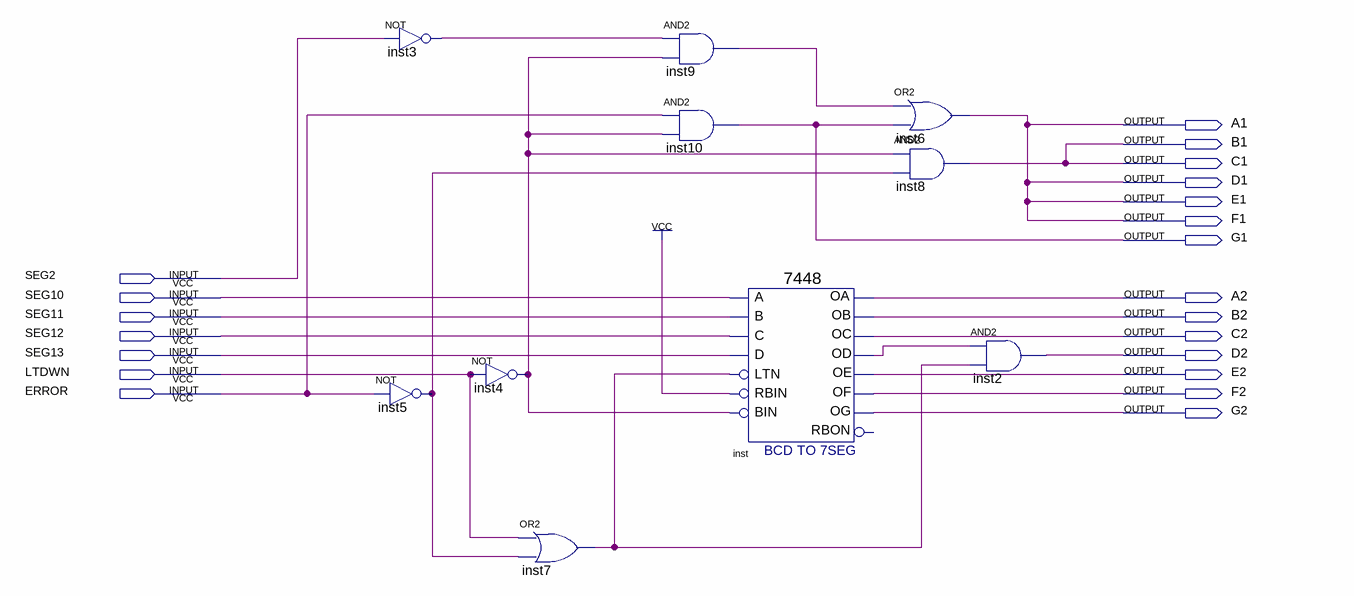
[diagram p0: schematic sheet]
// Quartus schematic display.bdf as structural Verilog: 10 symbols, 21 pins
module display (
  input  SEG2,
  input  SEG10,
  input  SEG11,
  input  SEG12,
  input  SEG13,
  input  LTDWN,
  input  ERROR,
  output A1,
  output B1,
  output C1,
  output D1,
  output E1,
  output F1,
  output G1,
  output A2,
  output B2,
  output C2,
  output D2,
  output E2,
  output F2,
  output G2
);

  wire inst3_out, inst4_out, inst5_out, inst7_out, inst9_out, inst_od;

  not inst3 (inst3_out, SEG2);
  not inst5 (inst5_out, ERROR);
  not inst4 (inst4_out, LTDWN);
  or inst7 (inst7_out, LTDWN, inst5_out);
  and inst9 (inst9_out, inst3_out, inst4_out);
  and inst10 (G1, ERROR, inst4_out);
  \7448  inst (
    .A(SEG10), .C(SEG12), .D(SEG13), .B(SEG11), .RBIN(1'b1), .BIN(inst4_out), .LTN(inst7_out), .OC(C2),
    .OE(E2), .OD(inst_od), .OF(F2), .OG(G2), .OB(B2), .OA(A2));  // open: RBON
  or inst6 (A1, inst9_out, G1);
  and inst8 (B1, inst4_out, inst5_out);
  and inst2 (D2, inst_od, inst7_out);

  assign C1 = B1;
  assign D1 = A1;
  assign E1 = A1;
  assign F1 = A1;
endmodule
